# EAGLE design 611_jetbot (EAGLE 9.5.1)
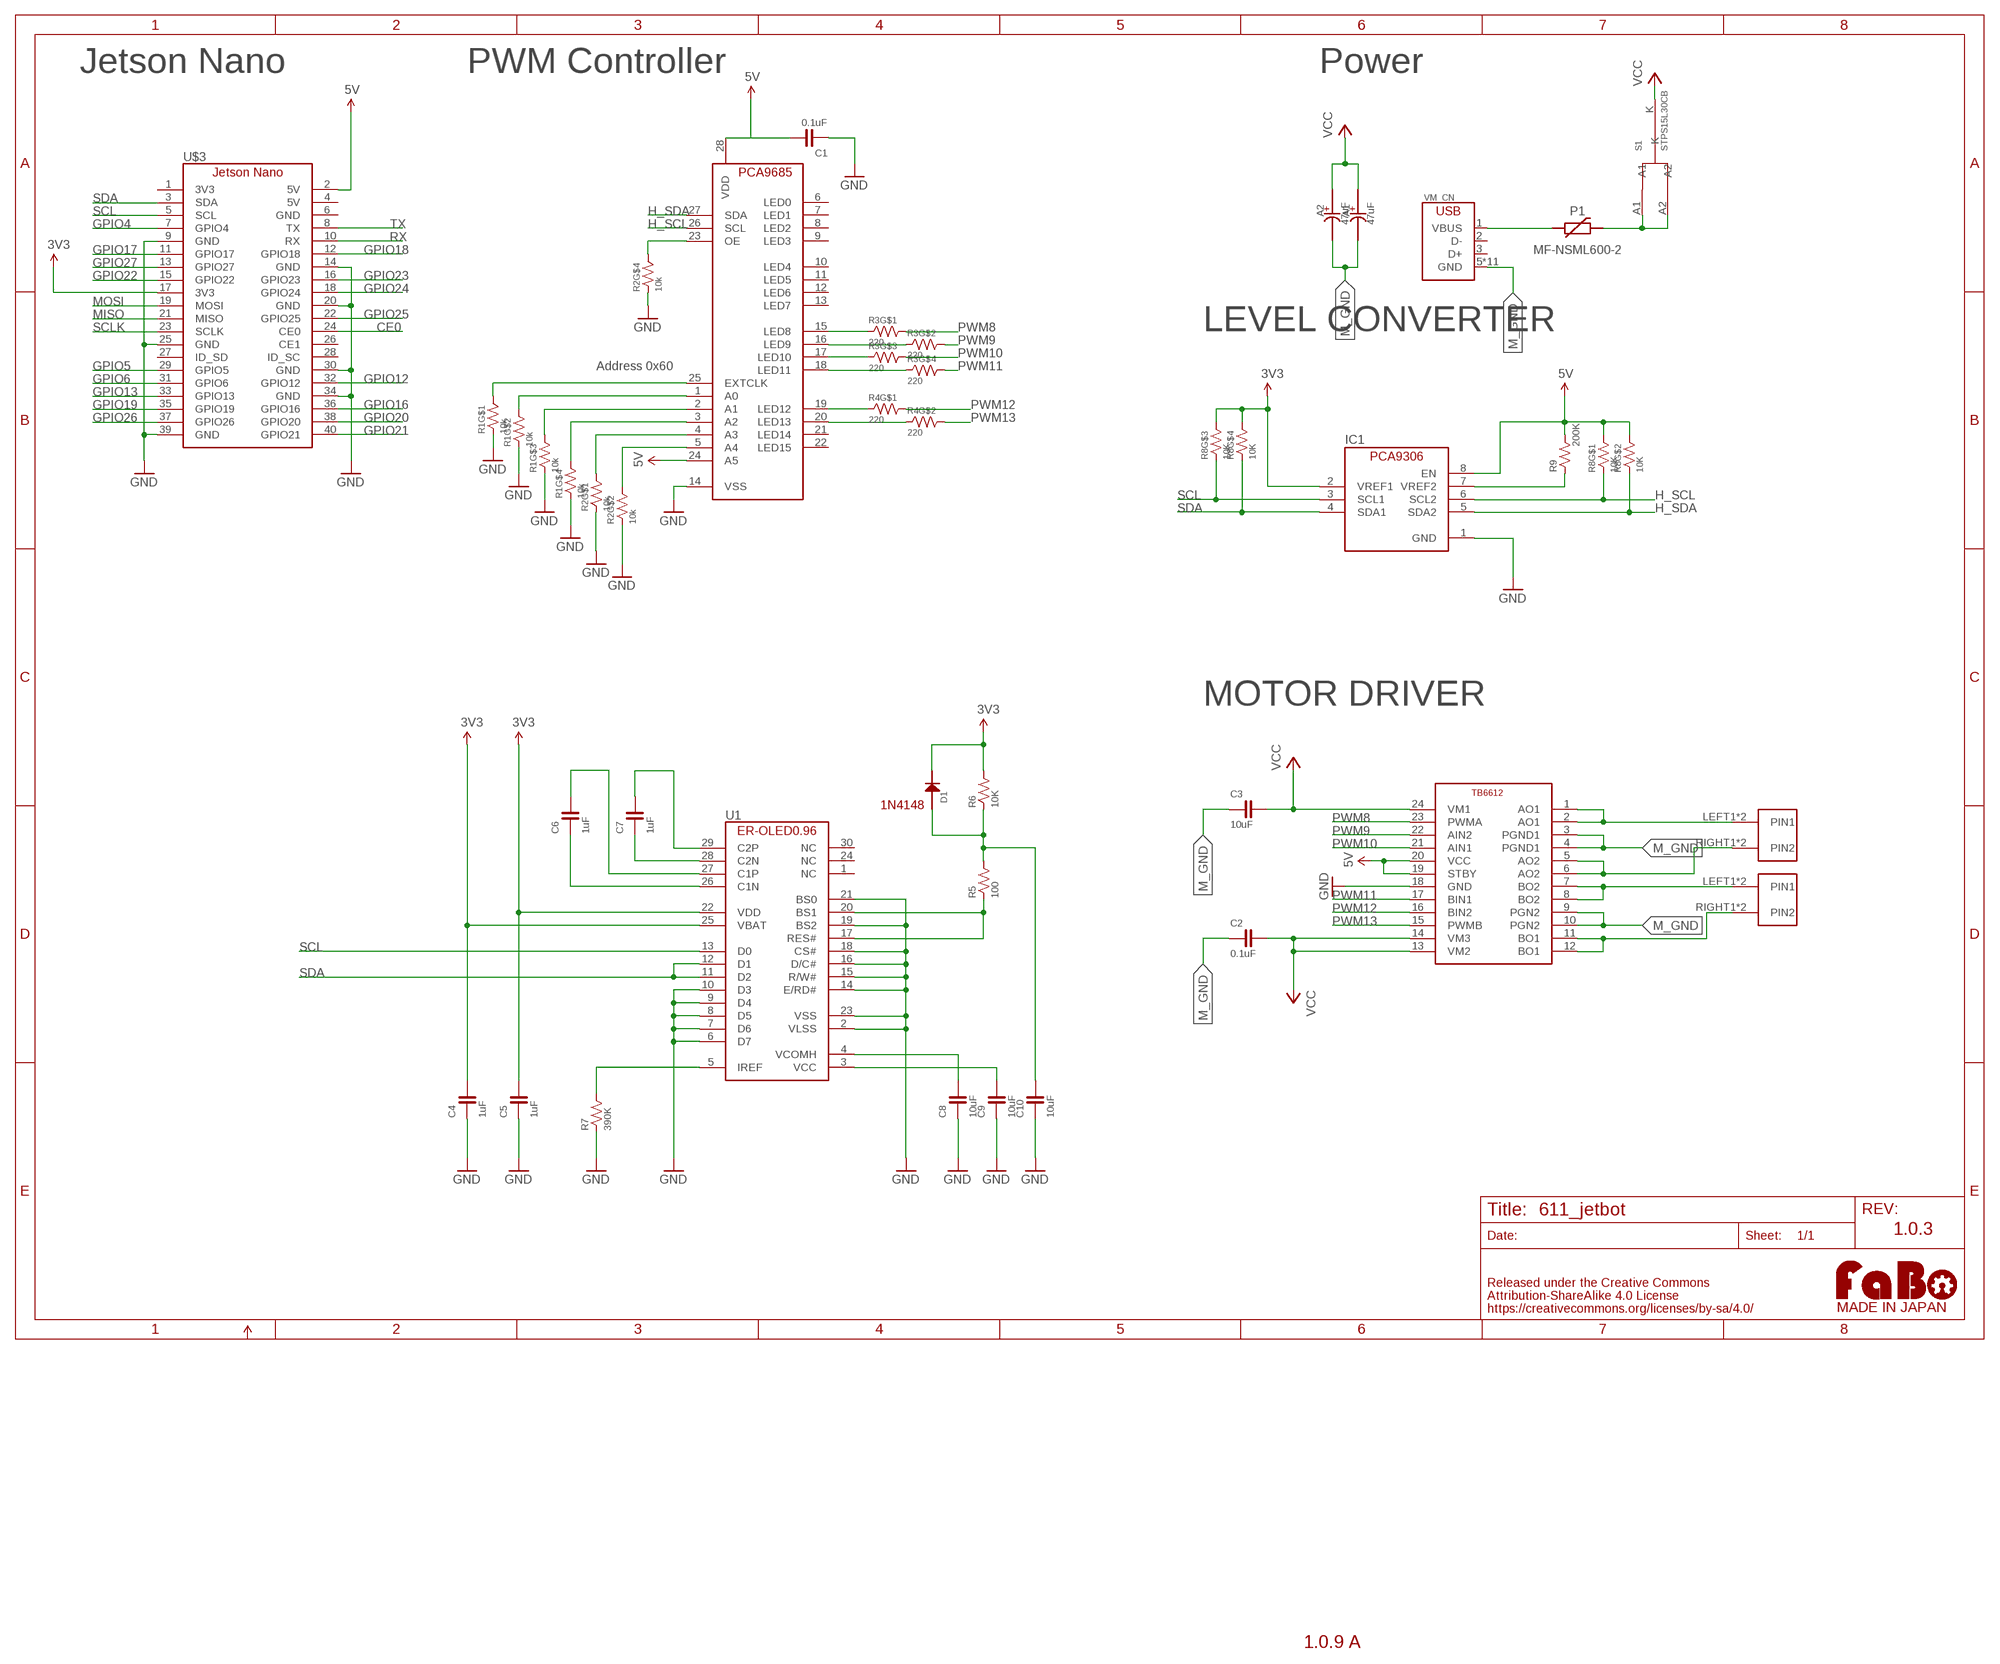
[diagram p0: schematic, sheet 1]

## Parts
A1  47uF  CAPACITOR-ALUMIN_D60  [D60]
A2  47uF  CAPACITOR-ALUMIN_D60  [D60]
C1  0.1uF  CAPACITOR-0603  [0603]
C2  0.1uF  CAPACITOR-0603  [0603]
C3  10uF  CAPACITOR-0603  [0603]
C4  1uF  CAPACITOR-0603-BOTTOM  [0603-BOTTOM]
C5  1uF  CAPACITOR-0603-BOTTOM  [0603-BOTTOM]
C6  1uF  CAPACITOR-0603-BOTTOM  [0603-BOTTOM]
C7  1uF  CAPACITOR-0603-BOTTOM  [0603-BOTTOM]
C8  10uF  CAPACITOR-0603-BOTTOM  [0603-BOTTOM]
C9  10uF  CAPACITOR-0603-BOTTOM  [0603-BOTTOM]
C10  10uF  CAPACITOR-0603-BOTTOM  [0603-BOTTOM]
D1  1N4148  [1N4148W]
IC1  PCA9306_SSOP  [8PIN-SSOP]
P1  MF-NSML600-2  POLYSWITCH1206  [1206]
R1  10k  RESISTOR_ARRAY  [EXBV8V]
R2  10k  RESISTOR_ARRAY  [EXBV8V]
R3  220  RESISTOR_ARRAY  [EXBV8V]
R4  220  RESISTOR_ARRAY  [EXBV8V]
R5  100  RESISTOR-0603-BOTTOM  [0603-BOTTOM]
R6  10K  RESISTOR-0603-BOTTOM  [0603-BOTTOM]
R7  390K  RESISTOR-0603-BOTTOM  [0603-BOTTOM]
R8  10K  RESISTOR_ARRAY  [EXBV8V]
R9  200K  RESISTOR-0603  [0603]
S1  STPS15L30CB  STPS15L30C  [STPS15L30C]
U1  ER-OLED0.96-1ER-CON30HT-1  [ER-CON30HT-1]
U$3  JETSON_NANO  [JETSON_NANO]
U$5  TB6612  [TB6612]
U$6  ML-1400-S1  [ML-1400-S1]
U$8  ML-1400-S1  [ML-1400-S1]
U$9  PCA9685  [PCA9685]
U$14  LOGO_FABO-M  [LOGO_FABO_MS]
VM_CN  USB-ZX62D  [ZX62D-B-5PA8]

## Nets
3V3: C4.2 D1.CATHODE IC1.2(VREF1) R6.2 R8.5 R8.6 U1.25(VBAT) U$3.17(3V3)
5V: C1.2 IC1.8(EN) R8.7 R8.8 R9.2 U$3.2(5V) U$5.19(STBY) U$5.20(VCC) U$9.24(A5) U$9.28(VDD)
CE0: U$3.24(CE0)
GND: C1.1 C4.1 C5.1 C8.1 C9.1 C10.1 IC1.1(GND) R1.1 R1.2 R1.3 R1.4 R2.1 R2.2 R2.4 R7.1 U1.2(VLSS) U1.6(D7) U1.7(D6) U1.8(D5) U1.9(D4) U1.10(D3) U1.14(E/RD#) U1.15(R/W#) U1.16(D/C#) U1.18(CS#) U1.19(BS2) U1.21(BS0) U1.23(VSS) U$3.9(GND) U$3.14(GND) U$3.20(GND) U$3.25(GND) U$3.30(GND) U$3.34(GND) U$3.39(GND) U$5.18(GND) U$9.14(VSS)
GPIO4: U$3.7(GPIO4)
GPIO5: U$3.29(GPIO5)
GPIO6: U$3.31(GPIO6)
GPIO12: U$3.32(GPIO12)
GPIO13: U$3.33(GPIO13)
GPIO16: U$3.36(GPIO16)
GPIO17: U$3.11(GPIO17)
GPIO18: U$3.12(GPIO18)
GPIO19: U$3.35(GPIO19)
GPIO20: U$3.38(GPIO20)
GPIO21: U$3.40(GPIO21)
GPIO22: U$3.15(GPIO22)
GPIO23: U$3.16(GPIO23)
GPIO24: U$3.18(GPIO24)
GPIO25: U$3.22(GPIO25)
GPIO26: U$3.37(GPIO26)
GPIO27: U$3.13(GPIO27)
H_SCL: IC1.6(SCL2) R8.1 U$9.26(SCL)
H_SDA: IC1.5(SDA2) R8.2 U$9.27(SDA)
M_GND: A1.MINUS(-) A2.MINUS(-) C2.1 C3.1 U$5.3(PGND1) U$5.4(PGND1) U$5.9(PGN2) U$5.10(PGN2) VM_CN.5(GND) VM_CN.B1(GND) VM_CN.B2(GND) VM_CN.B3(GND) VM_CN.B4(GND) VM_CN.T1(GND) VM_CN.T2(GND) VM_CN.T3(GND) VM_CN.T4(GND) VM_CN.T5(GND) VM_CN.T6(GND)
MISO: U$3.21(MISO)
MOSI: U$3.19(MOSI)
N$2: R3.1 U$9.15(LED8)
N$3: R3.2 U$9.16(LED9)
N$4: R3.3 U$9.17(LED10)
N$5: R3.4 U$9.18(LED11)
N$6: R4.1 U$9.19(LED12)
N$7: R2.5 U$9.23(OE)
N$8: R1.8 U$9.25(EXTCLK)
N$9: R1.7 U$9.1(A0)
N$10: R1.6 U$9.2(A1)
N$11: R1.5 U$9.3(A2)
N$12: R2.8 U$9.4(A3)
N$13: R2.7 U$9.5(A4)
N$14: C6.2 U1.27(C1P)
N$15: R4.2 U$9.20(LED13)
N$16: C6.1 U1.26(C1N)
N$17: U$5.1(AO1) U$5.2(AO1) U$6.LEFT1(PIN1) U$6.LEFT2(PIN1)
N$18: U$5.5(AO2) U$5.6(AO2) U$6.RIGHT1(PIN2) U$6.RIGHT2(PIN2)
N$19: C7.1 U1.28(C2N)
N$20: U$5.7(BO2) U$5.8(BO2) U$8.LEFT1(PIN1) U$8.LEFT2(PIN1)
N$21: C7.2 U1.29(C2P)
N$22: U$5.11(BO1) U$5.12(BO1) U$8.RIGHT1(PIN2) U$8.RIGHT2(PIN2)
N$23: R7.2 U1.5(IREF)
N$24: C8.2 U1.4(VCOMH)
N$25: C9.2 U1.3(VCC)
N$26: R5.1 U1.17(RES#) U1.20(BS1)
N$27: C10.2 D1.ANODE R5.2 R6.1
N$30: C5.2 U1.22(VDD) ; supply symbol labelled 3V3
N$33: IC1.7(VREF2) R9.1
PTCP1: P1.P$1 VM_CN.1(VBUS)
PTCP2: P1.P$2 S1.A1 S1.A2
PWM8: R3.8 U$5.23(PWMA)
PWM9: R3.7 U$5.22(AIN2)
PWM10: R3.6 U$5.21(AIN1)
PWM11: R3.5 U$5.17(BIN1)
PWM12: R4.8 U$5.16(BIN2)
PWM13: R4.7 U$5.15(PWMB)
RX: U$3.10(RX)
SCL: IC1.3(SCL1) R8.3 U1.13(D0) U$3.5(SCL)
SCLK: U$3.23(SCLK)
SDA: IC1.4(SDA1) R8.4 U1.11(D2) U1.12(D1) U$3.3(SDA)
TX: U$3.8(TX)
VCC: A1.PLUS(+) A2.PLUS(+) C2.2 C3.2 S1.K U$5.13(VM2) U$5.14(VM3) U$5.24(VM1)
Unconnected: R2.3 R2.6 R4.3 R4.4 R4.5 R4.6 U1.1(NC) U1.24(NC) U1.30(NC) U$3.1(3V3) U$3.4(5V) U$3.6(GND) U$3.26(CE1) U$3.27(ID_SD) U$3.28(ID_SC) U$9.6(LED0) U$9.7(LED1) U$9.8(LED2) U$9.9(LED3) U$9.10(LED4) U$9.11(LED5) U$9.12(LED6) U$9.13(LED7) U$9.21(LED14) U$9.22(LED15) VM_CN.2(D-) VM_CN.3(D+)

## Notes on the sheet
- Jetson Nano | PWM Controller | Power
- LEVEL CONVERTER
- Address 0x60
- MOTOR DRIVER
- 1N4148
- 1.0.3
- 1.0.9 A

## Library data of the parts
A1 A2 = FaBo-Capacitor:CAPACITOR-ALUMIN
C1-C10 = FaBo-Capacitor:CAPACITOR: CAPACITOR
D1 = FaBo-Diode:1N4148
IC1 = FaBo-LevelTranslator:PCA9306
P1 = FaBo-Supply:POLYSWITCH
R1-R4 R8 = component:RESISTOR_ARRAY
R5-R7 R9 = FaBo-Resistors:RESISTOR: RESISTOR
S1 = FaBo-Supply:STPS15L30C
U1 = FaBo-Display:ER-OLED0.96-1
U$3 = FaBo-Boards:JETSON_NANO
U$5 = FaBo-Motor:TB6612
U$6 U$8 = FaBo-Terminal:ML-1400-S1
U$9 = FaBo-Motor:PCA9685
U$14 = FaBo-etc:LOGO_FABO
VM_CN = component:USB

## Board
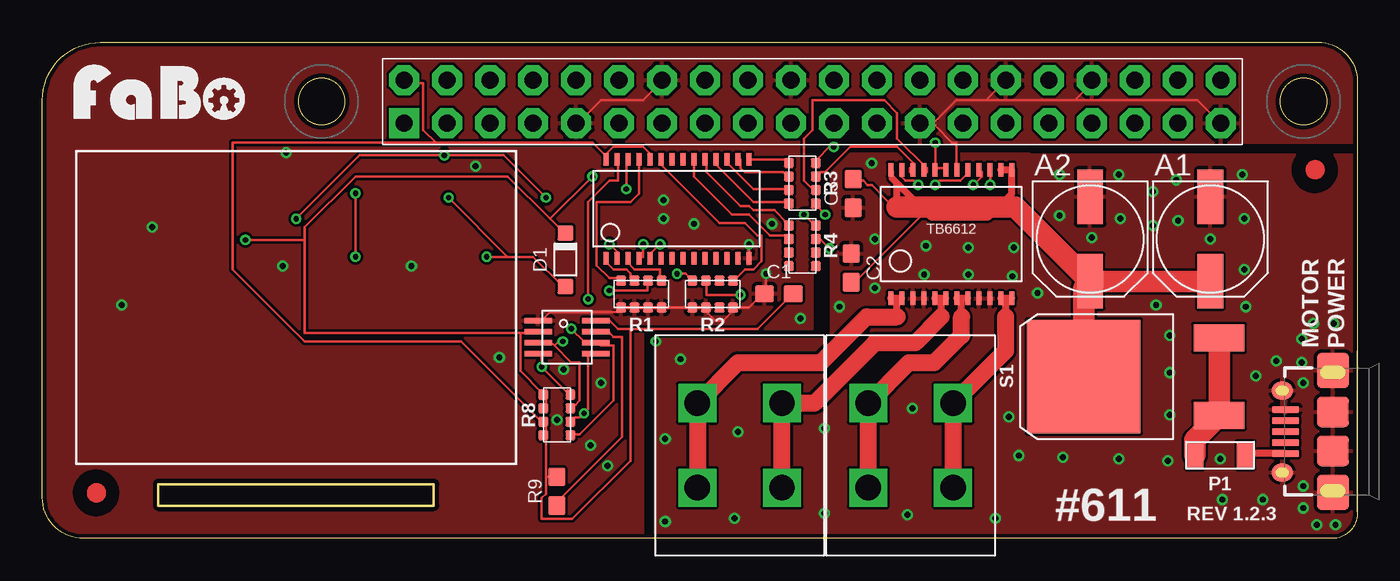
[diagram p1: board, top side]
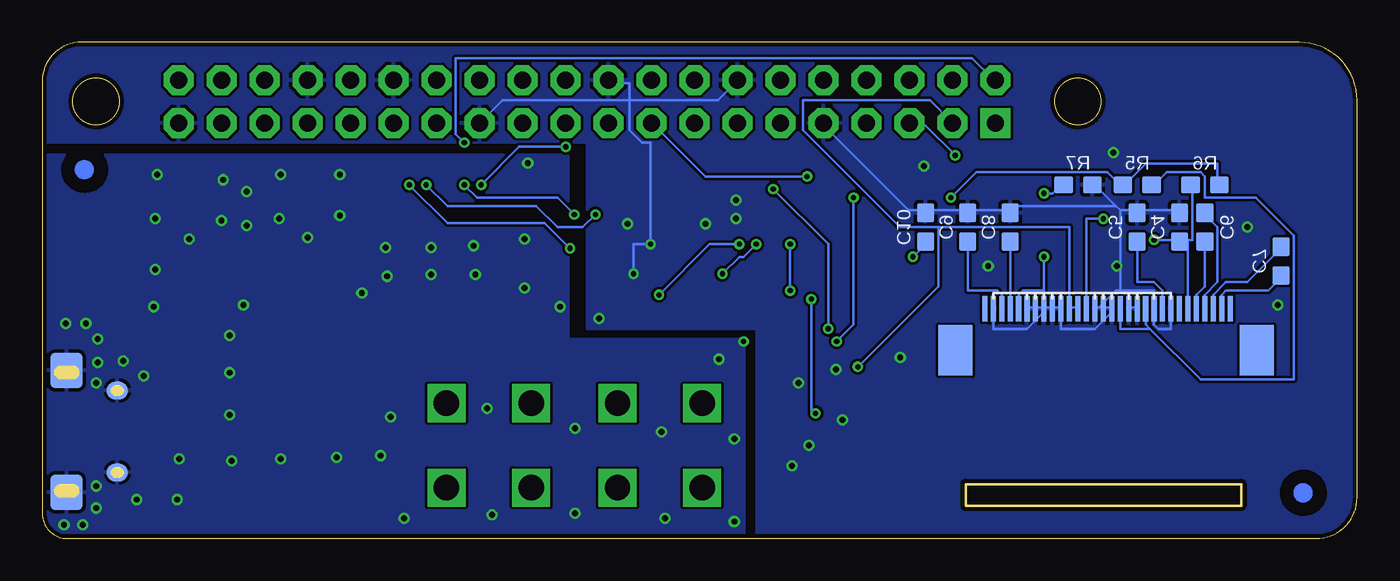
[diagram p2: board, bottom side, seen from below]

Size 77.68 x 29.33 mm. Coordinates in mm from the lower left corner, seen from the top.
Outline: 6.85,1.94 23.13,1.94 23.13,3.21 6.85,3.21 6.85,1.94
Copper layers (1*16): Top 0.035mm / dielectric 1.6mm / Bottom 0.035mm
Design rules "PCBway": minimum track width 6mil, minimum drill 12mil, track to track 6mil, track to pad 6mil, pad to pad 6mil, via to via 6mil, smd to smd 6mil, copper to edge 10mil, drill to drill 10mil, minimum pad ring 10mil, minimum via ring 6mil, stop-mask expansion 2mil, vias tented up to drill 100mil, thermal gap 8mil

### Footprints (pad centres in the part's own frame; a part is rotated, then mirrored left to right if it is on the bottom)
D60 = smd 3.2 x 1.524: MINUS -2.5,0; PLUS 2.5,0
0603 = smd 1.1 x 1: 1 -0.85,0; 2 0.85,0
0603-BOTTOM = smd 1.1 x 1 bottom: 1 -0.85,0; 2 0.85,0
1N4148W = smd 0.9 x 0.95: ANODE 0,0; CATHODE 3.15,0
8PIN-SSOP = smd 0.3 x 1.6: 1 -0.975,-1.7; 2 -0.325,-1.7; 3 0.325,-1.7; 4 0.975,-1.7; 5 0.975,1.7; 6 0.325,1.7; 7 -0.325,1.7; 8 -0.975,1.7
1206 = smd 1 x 1.6: P$1 -1.5,0; P$2 1.5,0
EXBV8V = smd 0.6 x 0.6: 1 -1.2,-0.8; 2 -0.4,-0.8; 3 0.4,-0.8; 4 1.2,-0.8; 5 1.2,0.8; 6 0.4,0.8; 7 -0.4,0.8; 8 -1.2,0.8
STPS15L30C = smd 1.6 x 3: A1 -2.286,-6.13; A2 2.286,-6.13 | smd 6.7 x 6.7: K 0,1.87
ER-CON30HT-1 = smd 0.3 x 1.5 bottom: 1 7,-0.23; 2 6.5,-0.23; 3 6,-0.23; 4 5.5,-0.23; 5 5,-0.23; 6 4.5,-0.23; 7 4,-0.23; 8 3.5,-0.23; 9 3,-0.23; 10 2.5,-0.23; 11 2,-0.23; 12 1.5,-0.23; 13 1,-0.23; 14 0.5,-0.23; 15 0,-0.23; 16 -0.5,-0.23; 17 -1,-0.23; 18 -1.5,-0.23; 19 -2,-0.23; 20 -2.5,-0.23; 21 -3,-0.23; 22 -3.5,-0.23; 23 -4,-0.23; 24 -4.5,-0.23; 25 -5,-0.23; 26 -5.5,-0.23; 27 -6,-0.23; 28 -6.5,-0.23; 29 -7,-0.23; 30 -7.5,-0.23 | smd 2 x 3 bottom: 31 -9.07,-2.67; 32 8.74,-2.67
JETSON_NANO = drill 1 pad 1.778 square: 1 -24.13,10.16 | drill 1 pad 1.778 octagon: 2 -24.13,12.7; 3 -21.59,10.16; 4 -21.59,12.7; 5 -19.05,10.16; 6 -19.05,12.7; 7 -16.51,10.16; 8 -16.51,12.7; 9 -13.97,10.16; 10 -13.97,12.7; 11 -11.43,10.16; 12 -11.43,12.7; 13 -8.89,10.16; 14 -8.89,12.7; 15 -6.35,10.16; 16 -6.35,12.7; 17 -3.81,10.16; 18 -3.81,12.7; 19 -1.27,10.16; 20 -1.27,12.7; 21 1.27,10.16; 22 1.27,12.7; 23 3.81,10.16; 24 3.81,12.7; 25 6.35,10.16; 26 6.35,12.7; 27 8.89,10.16; 28 8.89,12.7; 29 11.43,10.16; 30 11.43,12.7; 31 13.97,10.16; 32 13.97,12.7; 33 16.51,10.16; 34 16.51,12.7; 35 19.05,10.16; 36 19.05,12.7; 37 21.59,10.16; 38 21.59,12.7; 39 24.13,10.16; 40 24.13,12.7
TB6612 = smd 0.3 x 0.8: 1 -3.575,-3.8; 2 -2.925,-3.8; 3 -2.275,-3.8; 4 -1.625,-3.8; 5 -0.975,-3.8; 6 -0.325,-3.8; 7 0.325,-3.8; 8 0.975,-3.8; 9 1.625,-3.8; 10 2.275,-3.8; 11 2.925,-3.8; 12 3.575,-3.8; 13 3.575,3.8; 14 2.925,3.8; 15 2.275,3.8; 16 1.625,3.8; 17 0.975,3.8; 18 0.325,3.8; 19 -0.325,3.8; 20 -0.975,3.8; 21 -1.625,3.8; 22 -2.275,3.8; 23 -2.925,3.8; 24 -3.575,3.8
ML-1400-S1 = drill 1.5 square: LEFT1 -2.5,2.5; LEFT2 -2.5,-2.5; RIGHT1 2.5,2.5; RIGHT2 2.5,-2.5
PCA9685 = smd 0.3 x 0.75: 1 -4.15,-2.93; 2 -3.5,-2.93; 3 -2.85,-2.93; 4 -2.2,-2.93; 5 -1.55,-2.93; 6 -0.9,-2.93; 7 -0.25,-2.93; 8 0.4,-2.93; 9 1.05,-2.93; 10 1.7,-2.93; 11 2.35,-2.93; 12 3,-2.93; 13 3.65,-2.93; 14 4.3,-2.93; 15 4.3,2.92; 16 3.65,2.92; 17 3,2.92; 18 2.35,2.92; 19 1.7,2.92; 20 1.05,2.92; 21 0.4,2.92; 22 -0.25,2.92; 23 -0.9,2.92; 24 -1.55,2.92; 25 -2.2,2.92; 26 -2.85,2.92; 27 -3.5,2.92; 28 -4.15,2.92
ZX62D-B-5PA8 = smd 0.4 x 1.6: 1 -1.3,4.25; 2 -0.65,4.25; 3 0,4.25; 4 0.65,4.25; 5 1.3,4.25 | smd 1.05 x 1.25 bottom: B1 -2.425,4.45; B2 2.425,4.45 | smd 2.1 x 1.9 bottom: B3 -3.6,1.45; B4 3.6,1.45 | smd 1.05 x 1.25: T1 -2.425,4.45; T2 2.425,4.45 | smd 2.1 x 1.9: T3 -3.6,1.45; T6 3.6,1.45 | smd 1.8 x 1.9: T4 -1.15,1.45; T5 1.15,1.45

### Placement (x,y rotation side)
A1  69,17.7 270 top
A2  61.9,17.7 270 top
C1  43.52,14.47 0 top
C2  47.8,16 270 top
C3  47.9,20.4 90 top
C4  10.5,18.4 270 top
C5  13,18.4 270 top
C6  9,18.4 90 top
C7  4.5,16.4 270 top
C8  20.5,18.4 270 top
C9  23,18.4 270 top
C10  25.5,18.4 270 top
D1  30.9,14.9 90 top
IC1  31,11.9 270 top
P1  69.58,4.92 180 top
R1  35.39,14.44 0 top
R2  39.6,14.44 0 top
R3  44.9,21 270 top
R4  44.9,17.3 270 top
R5  13,20.9 0 top
R6  9,20.9 0 top
R7  16.5,20.9 0 top
R8  30.4,7.3 90 top
R9  30.4,2.8 90 top
S1  63.39,9.57 90 top
U1  15,13.8 0 top
U$2  [MARK_POINT_3MM]  3.2,2.7 0 top
U$3  45.5,14.4 0 top
U$4  [MARK_POINT_3MM]  75.2,21.8 0 top
U$5  53.7,18 0 top
U$6  41.2,5.5 0 top
U$7  [MARK_POINT_3MM_BOTTOM]  3.2,2.7 0 top
U$8  51.3,5.5 0 top
U$9  37.45,19.49 0 top
U$10  [MARK_POINT_3MM_BOTTOM]  75.2,21.8 0 top
U$14  6.92,24.38 0 top
VM_CN  77.7,6.32 90 top

### Tracks (layer width: path | path; a pad name or v marks a point on that pad's centre or on a via)
3V3  (via drill 0.3)
  Top 0.152: R8.6 29.75,7.9 29.75,8.4 R8.5 29.5,8.65 28.25,9.9 28.25,12.15 | 28.25,12.15 29.25,12.15 IC1.2 | 30,18.9 27.5,21.4 18.5,21.4 15.5,18.4 15.5,17.65 | 30,18.9 30.75,18.15 D1.CATHODE | 15.5,17.65 15.5,12.15 28.25,12.15 | 30,18.9 v32.5,21.4 | 15.5,17.65 v12,17.65
  Bottom 0.152: 10.5,17.65 10,17.65 | 10,17.65 9.75,17.65 9.75,20.9 R6.2 | 10,17.65 U1.25 | v32.5,21.4 38.5,21.4 41.5,24.4 U$3.17 | v12,17.65 10.5,17.65 | 10.5,17.65 C4.2
5V  (via drill 0.3)
  Top 0.152: 29.75,3.65 29.75,5.9 R8.8 29.75,6.15 29.75,6.9 R8.7 29.5,6.9 24.75,11.65 15.5,11.65 11.25,15.9 11.25,23.4 23.25,23.4 | R9.2 29.75,3.65 | 34.75,12.4 34,12.4 33.5,12.9 32.75,12.9 IC1.8 | 34.75,12.4 42.25,12.4 44.25,14.4 C1.2 | 29.75,3.65 29.75,2.65 29.5,2.4 29.5,1.15 31.3,1.15 34.75,4.6 34.75,12.4 | 33.25,22.65 33.75,23.15 35.5,23.15 36,22.65 U$9.24 | 52.75,21.9 53.25,21.9 U$5.19 | v52.75,23.4 52.75,21.9 | 52.75,21.9 U$5.20 | 33.25,22.65 32.5,23.4 23.25,23.4 | 23.25,23.4 22.5,24.15 22.5,26.9 21.5,26.9 U$3.2 | 33.25,22.65 U$9.28
  Bottom 0.152: v52.75,23.4 53.25,23.9 53.25,28.4 22.75,28.4 21.5,27.15 U$3.2
GND  (via drill 0.3, 0.35)
  Top 0.152: 52.5,24.4 52,24.4 U$3.25 52.5,24.4 | 52.5,24.4 52.75,24.4 53.75,23.4 54,23.4 54,21.9 U$5.18 | 55.75,25.9 56.75,26.9 U$3.30 | 55.75,25.9 54,25.9 52.5,24.4 | 61,25.9 62,26.9 U$3.34 | 55.75,25.9 61,25.9 | 61,25.9 68.25,25.9 69.5,24.65 U$3.39 | IC1.1 29.5,12.9 30,13.4 34,13.4 R1.1 34.25,13.65 34.75,13.65 R1.2 35.75,13.65 R1.3 36,13.65 36.5,13.65 R1.4 36.75,13.65 38.25,13.65 R2.1 38.5,13.65 39,13.65 R2.2 39.25,13.4 39.75,12.9 40.25,12.9 40.75,13.4 R2.4 41,13.65 41.75,13.65 42.5,14.4 C1.1 42.75,14.65 v42.75,15.65 | v41.75,17.4 41.75,16.65 U$9.14 | U$3.9 31.75,24.65 33,25.9 35.5,25.9 36.5,26.9 U$3.14
  Bottom 0.152: 18,13.65 17.5,13.65 U1.10 17.5,12.4 15.5,12.4 14.5,13.4 U1.16 14.5,13.65 15,13.65 | 18,13.65 18.5,13.65 | 18,13.65 U1.9 | 18.5,13.65 19,13.65 | 18.5,13.65 U1.8 18.5,13.4 19.5,12.4 21.5,12.4 U1.2 | 19,13.65 19.5,13.65 U1.6 | 19,13.65 U1.7 | U1.23 11,12.4 11.75,12.4 12,12.65 U1.21 12,14.65 13.5,14.65 | 13.5,13.65 13,13.65 U1.19 | 15,13.65 15.25,13.65 | 15.25,13.65 15.5,13.65 U1.14 | 15,13.65 U1.15 | 13.5,14.65 13.5,13.65 | 14,14.65 14.25,14.65 15.25,13.65 | 14,14.65 13.5,14.65 | 13.5,13.65 U1.18 | 23,19.4 20.5,19.4 | 23,19.4 25.5,19.4 | 23,19.4 C9.1 | 13,19.4 10.5,19.4 C4.1 | 14,19.4 14.25,19.65 | 14.25,19.65 15.5,20.9 R7.1 | 13,19.4 14,19.4 | 13,19.4 C5.1 | 20.5,19.4 20.25,19.65 14.25,19.65 | 20.5,19.4 C8.1 | 25.5,19.4 26.5,19.4 31.5,24.4 U$3.9 | 25.5,19.4 C10.1 | 14,19.4 14,14.65 | 43,25.9 43,26.9 44,26.9 U$3.20 | 43,25.9 43,24.15 42.25,23.4 41.75,23.4 v41.75,17.4 42.75,17.4 v42.75,15.65 | 43,25.9 37.75,25.9 36.75,26.9 U$3.14 | 43,25.9 50.5,25.9 51.75,24.65 U$3.25
  other vias: 6.5,18.4 4.7,13.8 21.8,16.1 14.2,16.1 14.4,22.8 27,10.7 30.8,10 30.4,7 32.4,5.5 33.4,4.3 25.6,22 33,9.2 36.7,20 36.7,18.9 38.5,18.6 43.1,18.6 44.8,13
  pour Top: -0.5,-1.6 35.5,-1.6 35.5,12.4 45.5,12.4 45.5,23.4 77.5,23.4 77.5,30.4 -0.5,30.4
  pour Bottom: -0.5,-1.6 35.5,-1.6 35.5,12.4 45.5,12.4 45.5,23.4 77.5,23.4 77.5,30.4 -0.5,30.4
H_SCL  (via drill 0.3)
  Top 0.152: R8.1 31.25,6.15 31.75,6.15 33.75,8.15 33.75,11.4 33,11.4 32.75,11.65 IC1.6 32.5,11.65 32,11.65 v31.25,12.4 | v34.5,20.65 34.5,22.4 U$9.26
  Bottom 0.152: v34.5,20.65 31.25,17.4 v31.25,12.4
H_SDA  (via drill 0.3)
  Top 0.152: R8.2 31.25,6.9 31.5,7.15 31.75,7.15 v32,7.4 32.25,7.65 32.25,10.9 32.5,10.9 IC1.5 | v32.25,14.15 32.25,19.9 33.5,21.15 34,21.15 34,22.4 U$9.27
  Bottom 0.152: v32.25,14.15 32.25,7.4 v32,7.4
M_GND  (via drill 0.3, 0.35)
  other vias: 36.25,11.65 37.7,10.6 49,22.2 76.3,12.7 75.1,12.7 74.4,11.8 74.4,10.4 74.5,9.2 74.5,3.1 74.5,1.8 75.3,0.8 76.4,0.8 66.6,12 66.6,9.8 66.6,7.3 66.5,4.6 63.6,4.7 60.3,4.8 57.7,4.9 57.1,7.2 56.3,1.2 51.1,1.4 51.4,7.7 46.2,6.5 46.2,1.5 40.9,1.2 41.1,6.3 36.8,5.9 36.8,1 52.2,17.3 54.7,17.2 57.4,17.2 57.3,15.5 54.7,15.6 52.1,15.6 47.1,13.7 49.2,17.7 65.6,20.5 65.6,18.5 69,17.7 62,17.8 71.1,13.7 71,15.9 70.9,21.5 71,18.9 67.1,18.8 67,21.2 63.6,21.5 63.7,18.9 60.1,19.1 60.1,21.5 49.2,14.8 65.8,13.8 58.8,14.5 69.6,4.7 69.7,2.3 72.1,2.3 71.7,9.6 72.9,10.5
  pour Top: 46.6,22.75 58.3,22.75 58.3,22.7 78.5,22.7 78.5,-1.1 36.2,-1.1 36.2,11.8 46.6,11.8
  pour Bottom: 36.2,11.8 46.6,11.8 46.6,22.7 77.5,22.7 77.5,-0.4 77.4,-0.5 36.2,-0.5
N$2
  Top 0.152: R3.1 44,22.4 U$9.15
N$3
  Top 0.152: R3.2 44,21.4 43.75,21.65 41.5,21.65 41.25,21.9 41.25,22.4 U$9.16
N$4
  Top 0.152: R3.3 44,20.65 42,20.65 40.5,22.15 40.5,22.4 U$9.17
N$5
  Top 0.152: R3.4 44,19.9 42,19.9 39.75,22.15 39.75,22.4 U$9.18
N$6
  Top 0.152: R4.1 44,18.65 43.25,19.4 42,19.4 41.75,19.65 41.25,19.65 39.25,21.65 39.25,22.4 U$9.19
N$7
  Top 0.152: R2.5 41,15.4 41.5,15.9 42,15.9 42.5,16.4 42.5,17.9 42.25,17.9 41.5,18.65 40,18.65 36.5,22.15 36.5,22.4 U$9.23
N$8
  Top 0.152: R1.8 34,15.4 33.5,15.4 32.75,16.15 32.75,19.9 34.75,19.9 35.25,20.4 U$9.25
N$9
  Top 0.152: R1.7 34.75,15.4 34.75,15.65 34.5,15.9 33.75,15.9 33.25,16.4 U$9.1
N$10  (via drill 0.3)
  Top 0.152: v33.5,14.65 35.75,14.65 35.75,15.15 R1.6 | v33.5,17.4 34,16.9 34,16.65 U$9.2
  Bottom 0.152: v33.5,17.4 v33.5,14.65
N$11
  Top 0.152: R1.5 36.5,15.4 36.5,15.9 35,15.9 34.5,16.4 U$9.3
N$12  (via drill 0.3)
  Top 0.152: v37.5,15.65 38,15.65 38.25,15.4 R2.8 | v35.5,17.4 35.5,16.65 35.25,16.65 U$9.4
  Bottom 0.152: v37.5,15.65 36.5,16.65 36.25,16.65 v35.5,17.4
N$13  (via drill 0.3)
  Top 0.152: v41.25,14.4 39.25,14.4 39.25,15.15 R2.7 | v36.5,17.4 36,16.9 36,16.65 U$9.5
  Bottom 0.152: v41.25,14.4 38.25,17.4 v36.5,17.4
N$14
  Bottom 0.152: U1.27 9,14.4 8.25,15.15 8.25,18.4 9,19.15 C6.2
N$15
  Top 0.152: R4.2 44,17.9 43,17.9 41.75,19.15 40.75,19.15 38.5,21.4 U$9.20
N$16
  Bottom 0.152: C6.1 9,14.9 9.5,14.4 U1.26
N$17
  Top 0.406: U$5.2 50.4,14.2 | 50.4,14.2 U$5.1 | 50.4,14.2 50.5,14.1 50.5,13.1
  Top 1.016: 50.5,13.1 48.7,13.1 46,10.4 41.1,10.4 U$6.LEFT1 U$6.LEFT2
N$18
  Top 0.406: U$5.6 53.1,14.2 | 53.1,14.2 U$5.5 | 53.1,14.2 53.1,13.1
  Top 1.016: 53.1,13.1 51.57,11.57 49.18,11.57 45.62,8 U$6.RIGHT1 U$6.RIGHT2
N$19
  Bottom 0.152: U1.28 8.5,14.4 7.75,15.15 6.5,15.15 4.5,17.15 C7.1
N$20
  Top 0.406: U$5.8 54.3,14.2 | 54.3,14.2 U$5.7 | 54.3,13.1 54.3,14.2
  Top 1.016: U$8.LEFT2 U$8.LEFT1 51.2,10.4 52.7,10.4 54.3,12 54.3,13.1
N$21
  Bottom 0.152: U1.29 8,14.4 7.75,14.65 5.25,14.65 4.5,15.4 C7.2
N$22
  Top 0.406: U$5.12 56.9,14.2 | 56.9,14.2 U$5.11 | 56.9,14.2 56.9,13.1
  Top 1.016: 56.9,13.1 56.9,11.1 U$8.RIGHT1 U$8.RIGHT2
N$23  (via drill 0.3)
  Top 0.152: v18.5,16.65 v18.5,20.4
  Bottom 0.152: v18.5,20.4 18,20.4 17.5,20.9 R7.2 | v18.5,16.65 18.5,14.65 19.75,14.65 20,14.4 U1.5
N$24
  Bottom 0.152: U1.4 C8.2
N$25
  Bottom 0.152: C9.2 23,14.65 21.25,14.65 21,14.4 U1.3
N$26
  Bottom 0.152: 12.25,12.4 12.5,12.65 U1.20 | 12.25,12.4 9.25,9.4 3.75,9.4 3.75,17.9 6,20.15 9,20.15 9,21.4 9.25,21.65 11.25,21.65 12,20.9 R5.1 | U1.17 14,12.4 12.25,12.4
N$27  (via drill 0.3)
  Top 0.152: v26.25,16.65 27.5,16.65 | 27.5,16.65 29,16.65 30.75,14.9 D1.ANODE | 27.5,16.65 v24,20.15
  Bottom 0.152: R6.1 8.25,20.9 8.25,22.15 12.5,22.15 13.75,20.9 R5.2 14,20.9 14.75,21.65 22.5,21.65 v24,20.15 | v26.25,16.65 25.5,17.4 C10.2
N$30
  Bottom 0.152: C5.2 13,15.15 12,15.15 11.5,14.65 U1.22
N$33
  Top 0.152: R9.1 30.6,2.35 34.25,6 34.25,11.9 33.75,11.9 33.5,12.15 32.75,12.15 IC1.7
PTCP1
  Top 0.406: VM_CN.1 71.18,5.02 P1.P$1
PTCP2
  Top 1.27: P1.P$2 68.08,5.84 S1.A1 S1.A2
PWM8  (via drill 0.3)
  Top 0.152: v46.75,23.15 46.5,23.15 45.75,22.4 R3.8 | v51.75,20.9 51.5,21.15 51,21.15 50.75,21.4 50.75,21.65 U$5.23
  Bottom 0.152: v46.75,23.15 49.5,23.15 v51.75,20.9
PWM9
  Top 0.152: R3.7 45.75,21.4 46,21.65 46.25,21.65 47.75,23.15 50.5,23.15 51.5,22.15 51.25,21.9 51.25,21.65 51.5,21.65 U$5.22
PWM10
  Top 0.152: R3.6 45.5,20.65 45,21.15 45,23.65 45.5,24.15 45.5,25.9 49.75,25.9 50.5,25.15 50.5,23.65 52.25,21.9 52.25,21.65 52,21.65 U$5.21
PWM11  (via drill 0.3)
  Top 0.152: v46.25,19.15 45.75,19.65 R3.5 | v52.75,20.9 53,21.15 54.25,21.15 54.75,21.65 U$5.17
  Bottom 0.152: v46.25,19.15 47.25,20.15 52,20.15 v52.75,20.9
PWM12  (via drill 0.3)
  Top 0.152: v45,19.15 45.5,18.65 R4.8 | v55,20.9 55.5,21.4 55.5,21.65 55.25,21.65 U$5.16
  Bottom 0.152: v45,19.15 45.75,18.4 47.25,18.4 48.5,19.65 53.75,19.65 v55,20.9
PWM13  (via drill 0.3)
  Top 0.152: v46.5,17.15 46,17.65 45.75,17.65 R4.7 | v56,20.9 56,21.65 U$5.15
  Bottom 0.152: v46.5,17.15 48,18.65 53.75,18.65 v56,20.9
SCL  (via drill 0.3)
  Top 0.152: 30.25,11.4 30,11.65 29.5,11.65 IC1.3 | 30.25,11.4 31.25,10.4 31.75,10.4 31.75,8.15 31.5,7.9 31.25,7.9 R8.3 | v15,18.9 18.75,22.65 v23.75,22.65 27.25,22.65 v29.75,20.15 | 30.25,11.4 30.5,11.65 v30.75,11.65
  Bottom 0.152: U1.13 16,18.9 v15,18.9 | v23.75,22.65 25.5,24.4 26.25,24.4 U$3.5 | v30.75,11.65 29.75,12.65 v29.75,20.15
SDA  (via drill 0.3)
  Top 0.152: R8.4 31,8.65 v29.5,10.15 29.5,10.9 IC1.4
  Bottom 0.152: 17,13.65 16.5,13.65 U1.12 | 17,13.65 17,18.4 24.75,18.4 | 24.75,18.4 27,18.4 32.75,24.15 32.75,25.9 25.25,25.9 U$3.3 | 17,13.65 U1.11 | v29.5,10.15 24.75,14.9 24.75,18.4
VCC
  Top 0.152: U$5.24 50.25,21.65 50.25,21.4 50.2,21.3 | 50.5,19.6 50,19.9 49,20.9 48.75,20.9 48.5,21.15 48,21.15 C3.2 | C2.2 48,15.15 52,19.15 52,19.6
  Top 0.406: 50.5,19.6 50.5,21 | 50.5,21 50.2,21.3 | 50.5,21 52.5,19 55.9,19 57.27,20.38 U$5.13 U$5.14
  Top 1.27: S1.K 61.52,14.82 A2.PLUS | A2.PLUS A1.PLUS | A2.PLUS 57.5,19.6 52,19.6 50.5,19.6

### Text on the board
tPlace: MOTOR / POWER | #611 | REV 1.2.3